# Altium schematic sheet ANT.SchDoc
size A4; DocumentNumber: 1; SheetNumber: 1; SheetTotal: 1
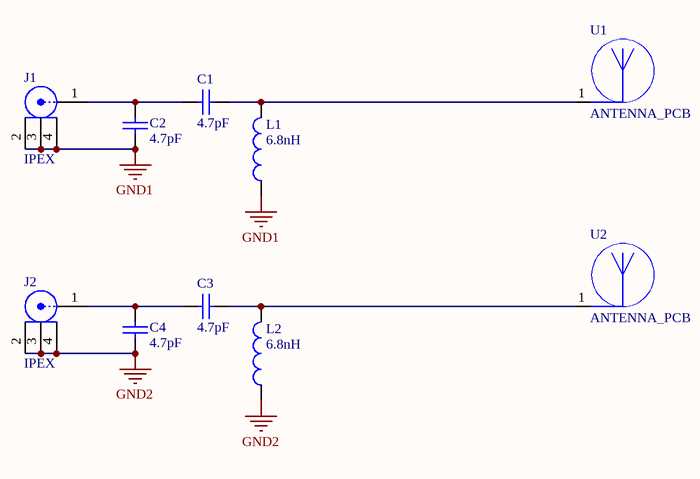
[diagram p0: ANT.SchDoc]

## Parts
C1  4.7pF  [R0603_C]
C2  4.7pF  [R0603_C]
C3  4.7pF  [R0603_C]
C4  4.7pF  [R0603_C]
J1  IPEX  [molex-73412]
J2  IPEX  [molex-73412]
L1  6.8nH  [R0603_L]
L2  6.8nH  [R0603_L]
U1  ANTENNA_PCB  [ANTENNA_HELICAL]
U2  ANTENNA_PCB  [ANTENNA_HELICAL]

## Nets
GND1: C2.1 J1.2 J1.3 J1.4 L1.1
GND2: C4.2 J2.2 J2.3 J2.4 L2.1
NetC1_1: C1.1 C2.2 J1.1
NetC1_2: C1.2 L1.2 U1.1
NetC3_1: C3.1 L2.2 U2.1
NetC3_2: C3.2 C4.1 J2.1

## Notes on the sheet
- Page
- of

## Library data of the parts
C1-C4 = 4.7pF/0603/100V: 精度 ±0.25pF / 容值 4.7pF / 额定电压 100V / 温漂系数（介质材料) C0G; 厂家: muRata(村田); 型号: GRM1885C2A4R7CA01D; 封装: 0603; 类型: Capacitor; 订货编码: C162260
J1 J2 = 73412-0110: RF同轴连接器（天线座）; 厂家: MOLEX; 型号: 734120110; 封装: SMD; 类型: IPEX插座; 订货编码: C434806; System: Connector
L1 L2 = 6.8nH/0603: 高频电感 / 精度 ±0.2nH / 额定电流 200mA / 直流电阻（内阻） 700mΩ / 电感值 6.8nH; 厂家: muRata(村田); 型号: LQP18MN6N8C02; 封装: 0603; 类型: Inductor; 订货编码: C19227
U1 U2 = ANTENNA_DN024: 厂家: 不是器件; 型号: 不是器件; 封装: 不是器件; 类型: 不是器件; 订货编码: 不是器件